# Altium schematic sheet steering-wheel.SchDoc
size A4
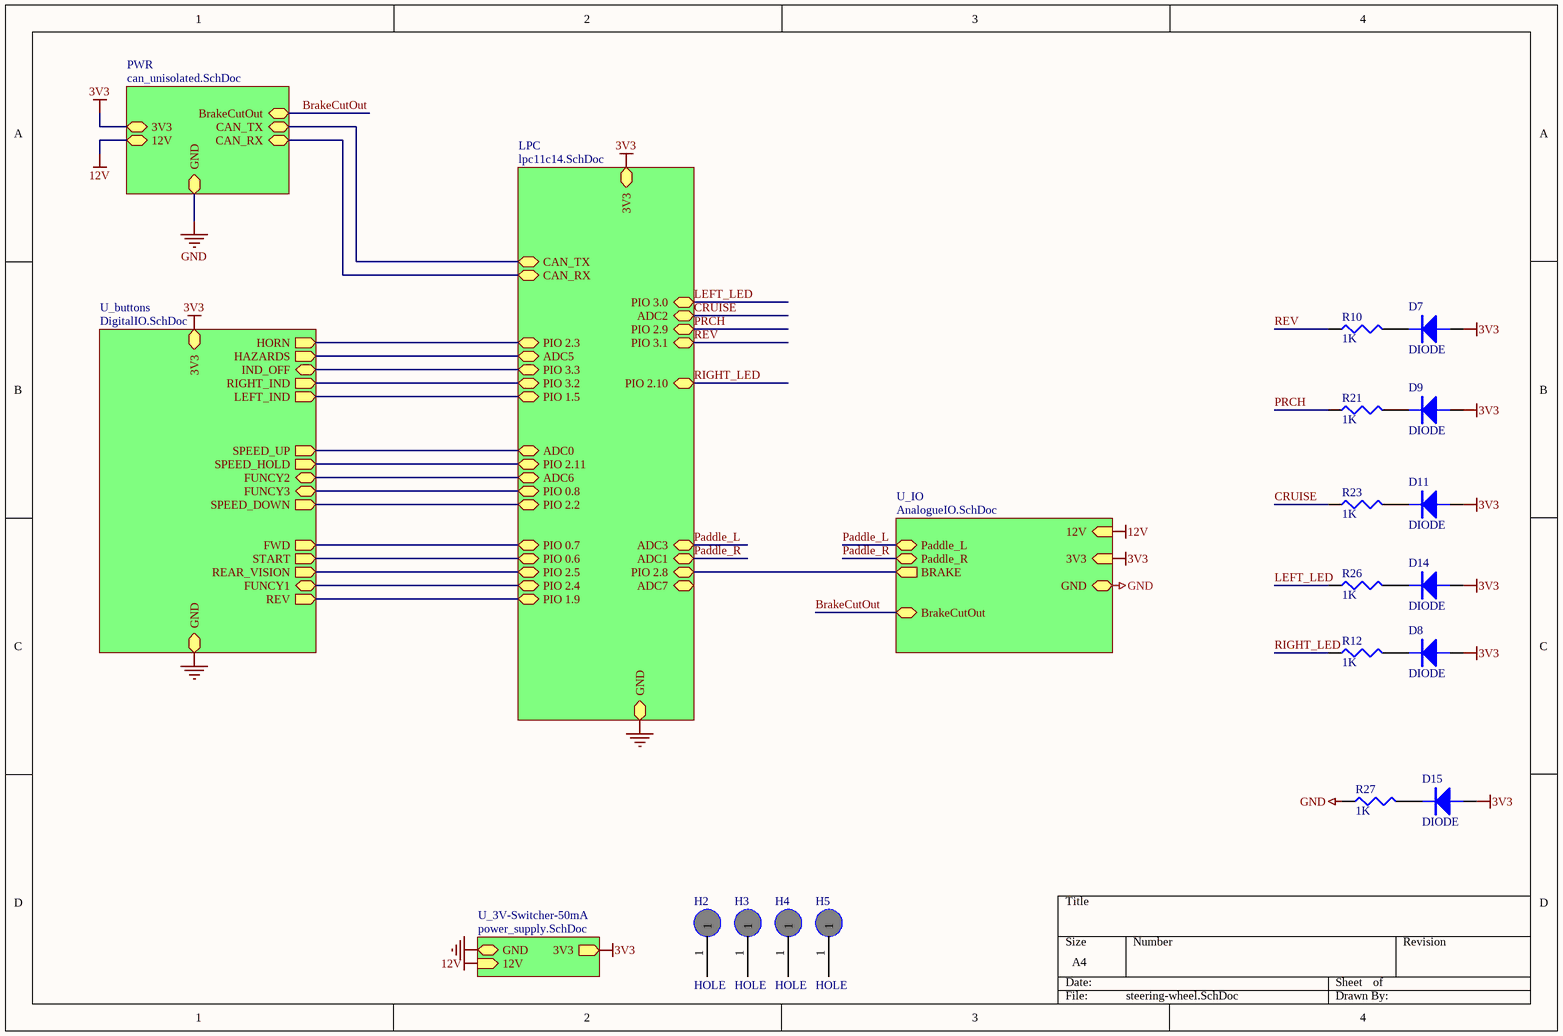
[diagram p0: steering-wheel.SchDoc]

## Parts
D7  DIODE  [3m Diode]
D8  DIODE  [3mm LED]
D9  DIODE  [3m Diode]
D11  DIODE  [3m Diode]
D14  DIODE  [3m Diode]
D15  DIODE  [3m Diode]
H2  HOLE  [M2.5]
H3  HOLE  [M2.5]
H4  HOLE  [M2.5]
H5  HOLE  [M2.5]
R10  1K  [0603]
R12  1K  [0603]
R21  1K  [0603]
R23  1K  [0603]
R26  1K  [0603]
R27  1K  [0603]

## Sub-sheets
LPC = lpc11c14.SchDoc: GND, 3V3, CAN_RX (bidir), CAN_TX, ADC3, ADC1, PIO 2.10, PIO 3.0, ADC2, ADC0, PIO 2.11, ADC6, PIO 0.8, PIO 2.2, PIO 0.7, PIO 0.6, PIO 2.5, PIO 2.4, PIO 1.9, PIO 2.3, ADC5, ADC7, PIO 3.2, PIO 1.5, PIO 3.3, PIO 2.9, PIO 3.1, PIO 2.8
PWR = can_unisolated.SchDoc: CAN_TX, CAN_RX, 3V3, 12V, GND, BrakeCutOut
U_3V-Switcher-50mA = power_supply.SchDoc: GND, 3V3, 12V
U_buttons = DigitalIO.SchDoc: HORN, RIGHT_IND, LEFT_IND, HAZARDS, 3V3, GND, SPEED_UP, REAR_VISION, SPEED_DOWN, FWD, SPEED_HOLD, START, IND_OFF, REV, FUNCY1, FUNCY2, FUNCY3
U_IO = AnalogueIO.SchDoc: 12V (in), 3V3 (in), GND, BRAKE (out), BrakeCutOut, Paddle_L, Paddle_R

## Nets
3V3: D7.A D8.A D9.A D11.A D14.A D15.A ; sheet U_buttons/3V3, sheet U_3V-Switcher-50mA/3V3, sheet U_IO/3V3, sheet LPC/3V3, sheet PWR/3V3
12V: sheet U_3V-Switcher-50mA/12V, sheet U_IO/12V, sheet PWR/12V
GND: R27.1 ; sheet U_buttons/GND, sheet U_3V-Switcher-50mA/GND, sheet U_IO/GND, sheet LPC/GND, sheet PWR/GND
BrakeCutOut: sheet U_IO/BrakeCutOut, sheet PWR/BrakeCutOut
CRUISE: R23.1 ; sheet LPC/ADC2
LEFT_LED: R26.1 ; sheet LPC/PIO 3.0
Paddle_L: sheet U_IO/Paddle_L, sheet LPC/ADC3
Paddle_R: sheet U_IO/Paddle_R, sheet LPC/ADC1
PRCH: R21.1 ; sheet LPC/PIO 2.9
REV: R10.1 ; sheet LPC/PIO 3.1
RIGHT_LED: R12.1 ; sheet LPC/PIO 2.10
NetD7_K: D7.K R10.2
NetD8_K: D8.K R12.2
NetD9_K: D9.K R21.2
NetD11_K: D11.K R23.2
NetD14_K: D14.K R26.2
NetD15_K: D15.K R27.2
(unnamed): sheet U_buttons/HORN, sheet LPC/PIO 2.3
(unnamed): sheet U_buttons/RIGHT_IND, sheet LPC/PIO 3.2
(unnamed): sheet U_buttons/LEFT_IND, sheet LPC/PIO 1.5
(unnamed): sheet U_buttons/HAZARDS, sheet LPC/ADC5
(unnamed): sheet U_buttons/SPEED_UP, sheet LPC/ADC0
(unnamed): sheet U_buttons/REAR_VISION, sheet LPC/PIO 2.5
(unnamed): sheet U_buttons/SPEED_DOWN, sheet LPC/PIO 2.2
(unnamed): sheet U_buttons/FWD, sheet LPC/PIO 0.7
(unnamed): sheet U_buttons/SPEED_HOLD, sheet LPC/PIO 2.11
(unnamed): sheet U_buttons/START, sheet LPC/PIO 0.6
(unnamed): sheet U_buttons/IND_OFF, sheet LPC/PIO 3.3
(unnamed): sheet U_buttons/REV, sheet LPC/PIO 1.9
(unnamed): sheet U_buttons/FUNCY1, sheet LPC/PIO 2.4
(unnamed): sheet U_buttons/FUNCY2, sheet LPC/ADC6
(unnamed): sheet U_buttons/FUNCY3, sheet LPC/PIO 0.8
(unnamed): sheet U_IO/BRAKE, sheet LPC/PIO 2.8
(unnamed): sheet LPC/CAN_RX, sheet PWR/CAN_RX
(unnamed): sheet LPC/CAN_TX, sheet PWR/CAN_TX

Not connected (* = marked no-connect by the designer): H2 1; H3 1; H4 1; H5 1

## Notes on the sheet
- Labels drawn without touching a wire or pin: GND

## Library data of the parts
R10 R12 R21 R23 R26 R27 = RES1: Resistor; Farnell: *